# Altium schematic sheet 0_Overview.SchDoc: Overview
size A3; DocumentNumber: 1; SheetNumber: 1; SheetTotal: 6; PageSetup: Record=PageOptions|CenterHorizontal=True|CenterVertical=True|PrintScale=1.01|XCorrection=1.00|YCorrection=1.00|PrintKind=0|BorderSize=5000000|LeftOffset=0|BottomOffset=0|Orientation=2|PaperLength=1000|PaperWidth=1000|Scale=100|PaperSource=7|PrintQuality=-4|MediaType=1|DitherType=10|PaperKind=A3|PrintScaleMode=1
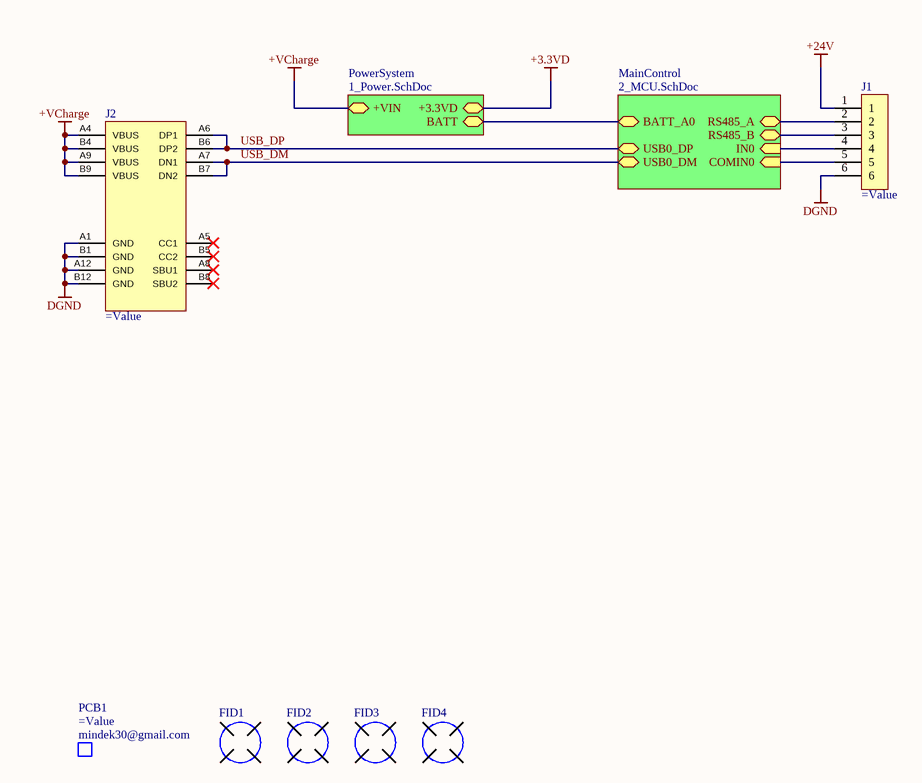
[diagram p0: 0_Overview.SchDoc]

## Parts
FID1  FIDUCIAL  [FID]  (value not drawn)  (no BOM)
FID2  FIDUCIAL  [FID]  (value not drawn)  (no BOM)
FID3  FIDUCIAL  [FID]  (value not drawn)  (no BOM)
FID4  FIDUCIAL  [FID]  (value not drawn)  (no BOM)
J1  (no value)  [CON_6P_Terminal]
J2  (no value)  [2137160001_MOL_2137160001(Primary)]
PCB1  Manufacturer: mindek30@gmail.com  (mechanical)

## Sub-sheets
MainControl = 2_MCU.SchDoc: BATT_A0 (bidir), RS485_A (bidir), RS485_B (bidir), USB0_DP (bidir), USB0_DM (bidir), IN0 (in), COMIN0 (in)
PowerSystem = 1_Power.SchDoc: +3.3VD (bidir), BATT (bidir), +VIN (bidir)

## Nets
+3.3VD: sheet PowerSystem/+3.3VD
+24V: J1.1
+VCharge: J2.A4(VBUS) J2.A9(VBUS) J2.B4(VBUS) J2.B9(VBUS) ; sheet PowerSystem/+VIN
DGND: J1.6 J2.A1(GND) J2.A12(GND) J2.B1(GND) J2.B12(GND)
USB_DM: J2.A7(DN1) J2.B7(DN2) ; sheet MainControl/USB0_DM
USB_DP: J2.A6(DP1) J2.B6(DP2) ; sheet MainControl/USB0_DP
NetJ1_2: J1.2 ; sheet MainControl/RS485_A
NetJ1_3: J1.3 ; sheet MainControl/RS485_B
NetJ1_4: J1.4 ; sheet MainControl/IN0
NetJ1_5: J1.5 ; sheet MainControl/COMIN0
(unnamed): sheet MainControl/BATT_A0, sheet PowerSystem/BATT

Not connected (* = marked no-connect by the designer): J2 A5(CC1)* A8(SBU1)* B5(CC2)* B8(SBU2)*

## Notes on the sheet
- Title :
- Revision :
- ผู้จัดทำ:
- Size:
- A3
- Time:
- ผู้เขียน:
- บริษัท ยูนิเวอร์แซล ยูทีลิตี้ส์ จำกัด (มหาชน) เลขที่ 1 อาคาร อีสท์วอเตอร์ ชั้น 18 ซอยวิภาวดีรังสิต 5 แขวงจอมพล เขตจตุจักร กรุงเทพฯ 10900
  Tel : +662-272-1688
  Fax :+662-2721690-1
- -
- Sheet:
- of
- ผู้อำนวยการ
- ผู้ตรวจสอบ:
- Number:
- กรรมการผู้จัดการ:
- File:

## Library data of the parts
FID1-FID4 = FID_FIDUCIAL: Manufacturer: mindek30@gmail.com; Value2: Non SE; Value: Non SE; PartNumber: =PCB_PN+'_'+PCB_Rev; PartID: =PCB_Rev; PackageReference: Non SE; Value3: Non SE
J1 = CON_6P_Terminal: TERM BLOCK HDR 6POS 90DEG 3.5MM; PartNumber: 1843839; Manufacturer: Phoenix Contact; Value: 1843839; PartID: 277-6291-ND; PackageReference: *; Value2: *; Value3: *
J2 = CON_USBC: CONN RCPT USB2.0 TYPE C 24POS RA; PartNumber: 2137160001; Manufacturer: Molex; Value: 2137160001; PartID: 900-2137160001CT-ND; PackageReference: *; Value2: *; Value3: *
PCB1 = PCB_Bare: BARE PCB; PartNumber: =PCB_PN+'_'+PCB_Rev; PackageReference: Non SE; PartID: =PCB_Rev; Value2: =JobFile_Title; Value: =PartNumber; Value3: =PCBA_PN+'_'+PCBA_Rev